# Altium schematic sheet S7CAS-PLEIADES-CARTE-MERE_P02_TITLE_PAGE.SchDoc
size Tabloid; DocumentNumber: 1; SheetNumber: 1; SheetTotal: 14; Sheet_Name: Insert name in Document Parameters; Size: 11x17
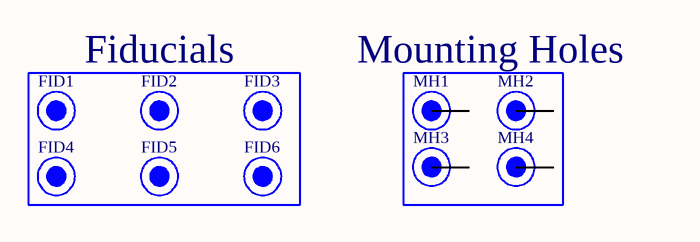
[diagram p0: S7CAS-PLEIADES-CARTE-MERE_P02_TITLE_PAGE.SchDoc]

## Parts
FID1  Fiducial 1mm  [FID_1MM]  (value not drawn)  (no BOM)
FID2  Fiducial 1mm  [FID_1MM]  (value not drawn)  (no BOM)
FID3  Fiducial 1mm  [FID_1MM]  (value not drawn)  (no BOM)
FID4  Fiducial 1mm  [FID_1MM]  (value not drawn)  (no BOM)
FID5  Fiducial 1mm  [FID_1MM]  (value not drawn)  (no BOM)
FID6  Fiducial 1mm  [FID_1MM]  (value not drawn)  (no BOM)
MH1  Mounting Hole 6-32  [MH_ENG_6-32]  (value not drawn)  (no BOM)
MH2  Mounting Hole 6-32  [MH_ENG_6-32]  (value not drawn)  (no BOM)
MH3  Mounting Hole 6-32  [MH_ENG_6-32]  (value not drawn)  (no BOM)
MH4  Mounting Hole 6-32  [MH_ENG_6-32]  (value not drawn)  (no BOM)

## Blocks framed on the sheet
Fiducials: FID1-FID6

## Nets

Not connected (* = marked no-connect by the designer): MH1 1; MH2 1; MH3 1; MH4 1

## Notes on the sheet
- Mounting Holes
- Revision history
- Package size conversion
- Metric
- 1005
- 1608
- Imperial
- 0402
- 0603
- Revision
- 2012
- 3216
- 0805
- 1206
- 3225
- 6432
- 1210
- 2512
- Date :
- Project Title
- Global Project
- Size
- Group
- Date
- Sheet
- of
- Filename
- Designers

## Library data of the parts
FID1-FID6 = FID_1MM: FID - 1MM; Current: *; Mfg Part Number: *; HelpURL: *; CreatedBy: Jonathan Bouchard; VerifiedBy: Alexandre Imbeault; FootprintNameOK: Jonathan Bouchard; Temperature: *; Power: *; Precision: *; Value: *; Mfg: *; Package: *; Voltage: *
MH1-MH4 = MH_6-32: MH - Mounting Hole 6-32; Current: *; Mfg Part Number: *; HelpURL: *; CreatedBy: Jonathan Bouchard; VerifiedBy: Alexandre Imbeault; FootprintNameOK: Jonathan Bouchard; Temperature: *; Power: *; Precision: *; Value: *; Mfg: *; Package: *; Voltage: *